# EAGLE design PCB-PWR-CON (EAGLE 6.2)
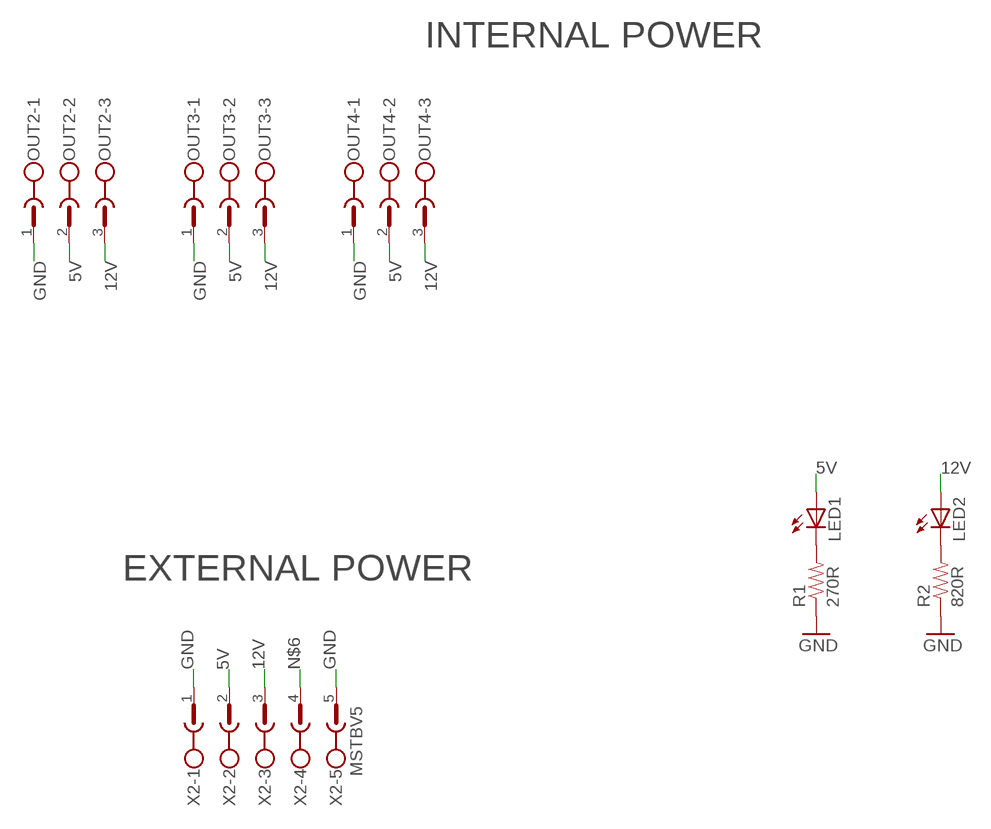
[diagram p0: schematic, sheet 1]

## Parts
LED1  LED3MM  [LED3MM]
LED2  LED3MM  [LED3MM]
OUT2  CON1  MSTBV3  [MSTBV3]
OUT3  CON1  MSTBV3  [MSTBV3]
OUT4  CON1  MSTBV3  [MSTBV3]
R1  270R  RESISTOR0603-RES  [0603-RES]
R2  820R  RESISTOR0603-RES  [0603-RES]
X2  MSTBV5  [MSTBV5]

## Nets
5V [PWR]: LED1.A OUT2.2 OUT3.2 OUT4.2 X2.2
12V [PWR]: LED2.A OUT2.3 OUT3.3 OUT4.3 X2.3
GND [PWR]: OUT2.1 OUT3.1 OUT4.1 R1.1 R2.1 X2.1 X2.5
N$1: LED1.K(C) R1.2
N$2: LED2.K(C) R2.2
N$6: X2.4

## Notes on the sheet
- INTERNAL POWER
- EXTERNAL POWER

## Library data of the parts
LED1 LED2 = SparkFun:LED: LEDs Standard schematic elements and footprints for 5mm, 3mm, 1206, and 0603 sized LEDs. 5mm - Spark Fun Electronics SKU : COM-00529 (and others)
OUT2-OUT4 = con-phoenix-508:MSTBV3: PHOENIX; MPN: MSTBV 2,5/3-GF-5.08; OC_FARNELL: 1792793; OC_NEWARK: 69R9846
R1 R2 = SparkFun:RESISTOR: Resistor Basic schematic elements and footprints for 0603, 1206, and PTH resistors.
X2 = con-phoenix-508:MSTBV5: PHOENIX; MPN: MSTBV 2,5/5-GF-5.08; OC_FARNELL: 1792795; OC_NEWARK: 69R9848

## Net classes
0 default: width 0.254 mm, drill 0.406 mm, clearance 0.254 mm
1 PWR: width 1.778 mm, clearance 0.61 mm

## Board
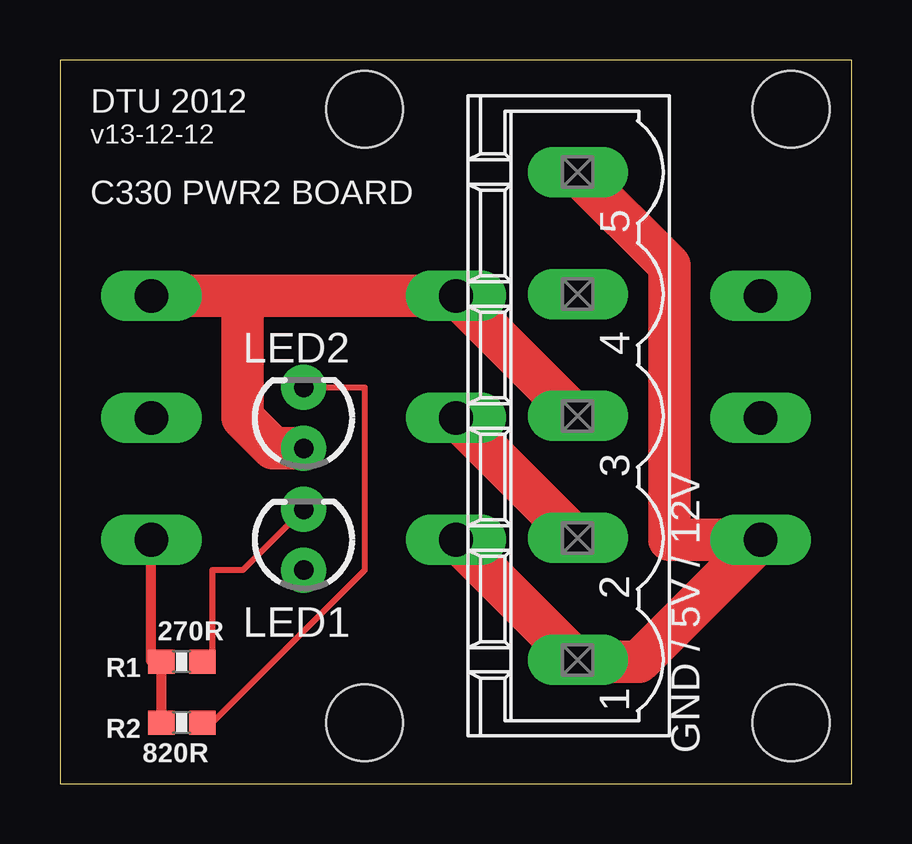
[diagram p1: board, top side]
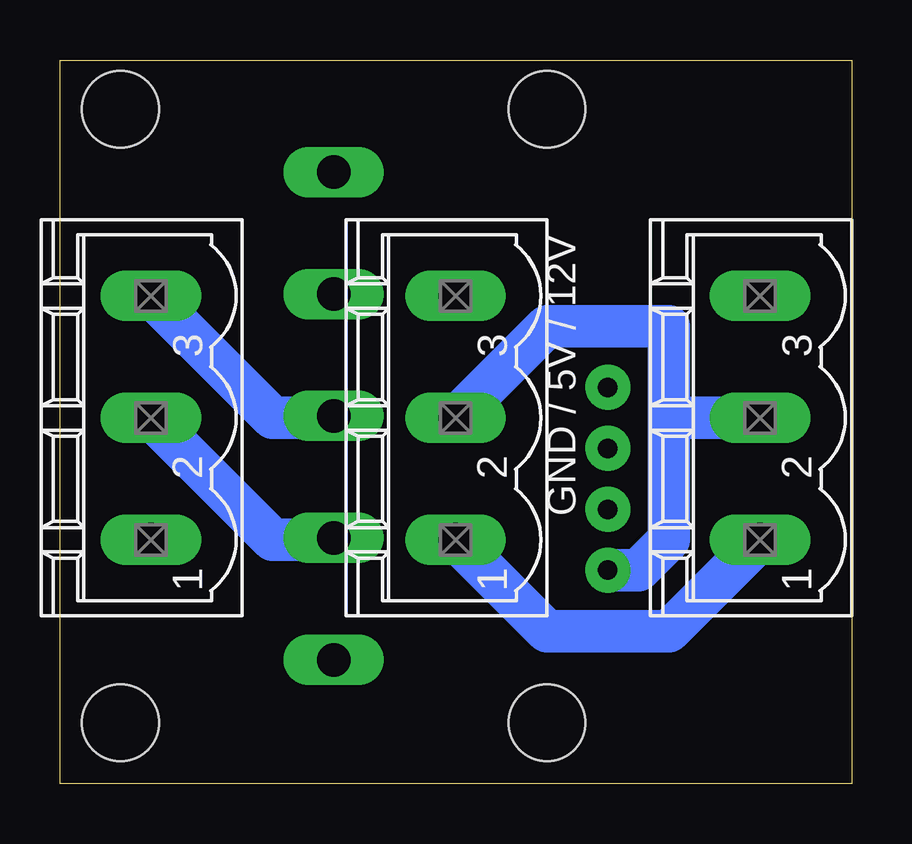
[diagram p2: board, bottom side, seen from below]

Size 33 x 30.15 mm. Coordinates in mm from the lower left corner, seen from the top.
Outline: 0,0 33,0 33,30.15 0,30.15 0,0
Copper layers (1*16): Top 0.035mm / dielectric 1.5mm / Bottom 0.035mm
Design rules: minimum track width 6mil, minimum drill 12mil, track to track 6mil, track to pad 6mil, pad to pad 6mil, via to via 6mil, smd to smd 0mil, copper to edge 10mil, drill to drill 10mil, minimum pad ring 10mil, minimum via ring 6mil, stop-mask expansion 2mil, vias tented up to drill 100mil, thermal gap 10mil
Holes 3.2 mm at 12.7,2.54 30.48,2.54 12.7,28.1 30.48,28.1

### Footprints (pad centres in the part's own frame; a part is rotated, then mirrored left to right if it is on the bottom)
LED3MM = drill 0.813 pad 1.88: A -1.27,0; K 1.27,0
MSTBV3 = drill 1.397 long: 1 -5.08,0; 2 0,0; 3 5.08,0
0603-RES = smd 1.1 x 1: 1 -0.85,0; 2 0.85,0
MSTBV5 = drill 1.397 long: 1 -10.16,0; 2 -5.08,0; 3 0,0; 4 5.08,0; 5 10.16,0

### Placement (x,y rotation side)
LED1  10.16,10.16 90 top
LED2  10.16,15.24 90 top
OUT2  16.51,15.24 90 bottom
OUT3  29.21,15.24 90 bottom
OUT4  3.81,15.24 90 bottom
R1  5.08,5.08 0 top
R2  5.08,2.54 0 top
X2  21.59,15.32 90 top

### Tracks (layer width: path | path; a pad name or v marks a point on that pad's centre or on a via)
5V
  Top 1.778: OUT2.2 21.59,10.16 X2.2
  Bottom 1.778: LED1.A 8.89,8.89 7.62,10.16 7.62,15.24 | OUT4.2 7.62,15.24 | OUT3.2 24.13,10.16 21.59,10.16 X2.2 | 7.62,15.24 7.62,19.05 12.7,19.05 OUT2.2
12V
  Top 1.778: LED2.A 8.89,13.97 7.62,15.24 7.62,20.32 | OUT4.3 7.62,20.32 | X2.3 21.59,15.24 OUT2.3 7.62,20.32
  Bottom 1.778: OUT3.3 24.13,15.24 21.59,15.24 X2.3
GND
  Top 0.406: R2.1 R1.1 3.81,5.08 OUT4.1
  Top 1.778: OUT2.1 21.59,5.08 | 21.59,5.08 24.13,5.08 OUT3.1 25.4,10.16 25.4,21.59 21.59,25.4 X2.5 | 21.59,5.08 X2.1
  Bottom 1.778: OUT4.1 7.62,6.35 12.7,6.35 OUT2.1
N$1
  Top 0.254: LED1.K 7.62,8.89 6.35,8.89 6.35,5.08 R1.2
N$2
  Top 0.254: LED2.K 12.7,16.51 12.7,8.89 6.35,2.54 R2.2

### Text on the board
_tsilk: DTU 2012 | v13-12-12 | C330 PWR2 BOARD | GND / 5V / 12V
_bsilk: GND / 5V / 12V